# EAGLE schematic x16-to-mxm3 (EAGLE 9.6.2)
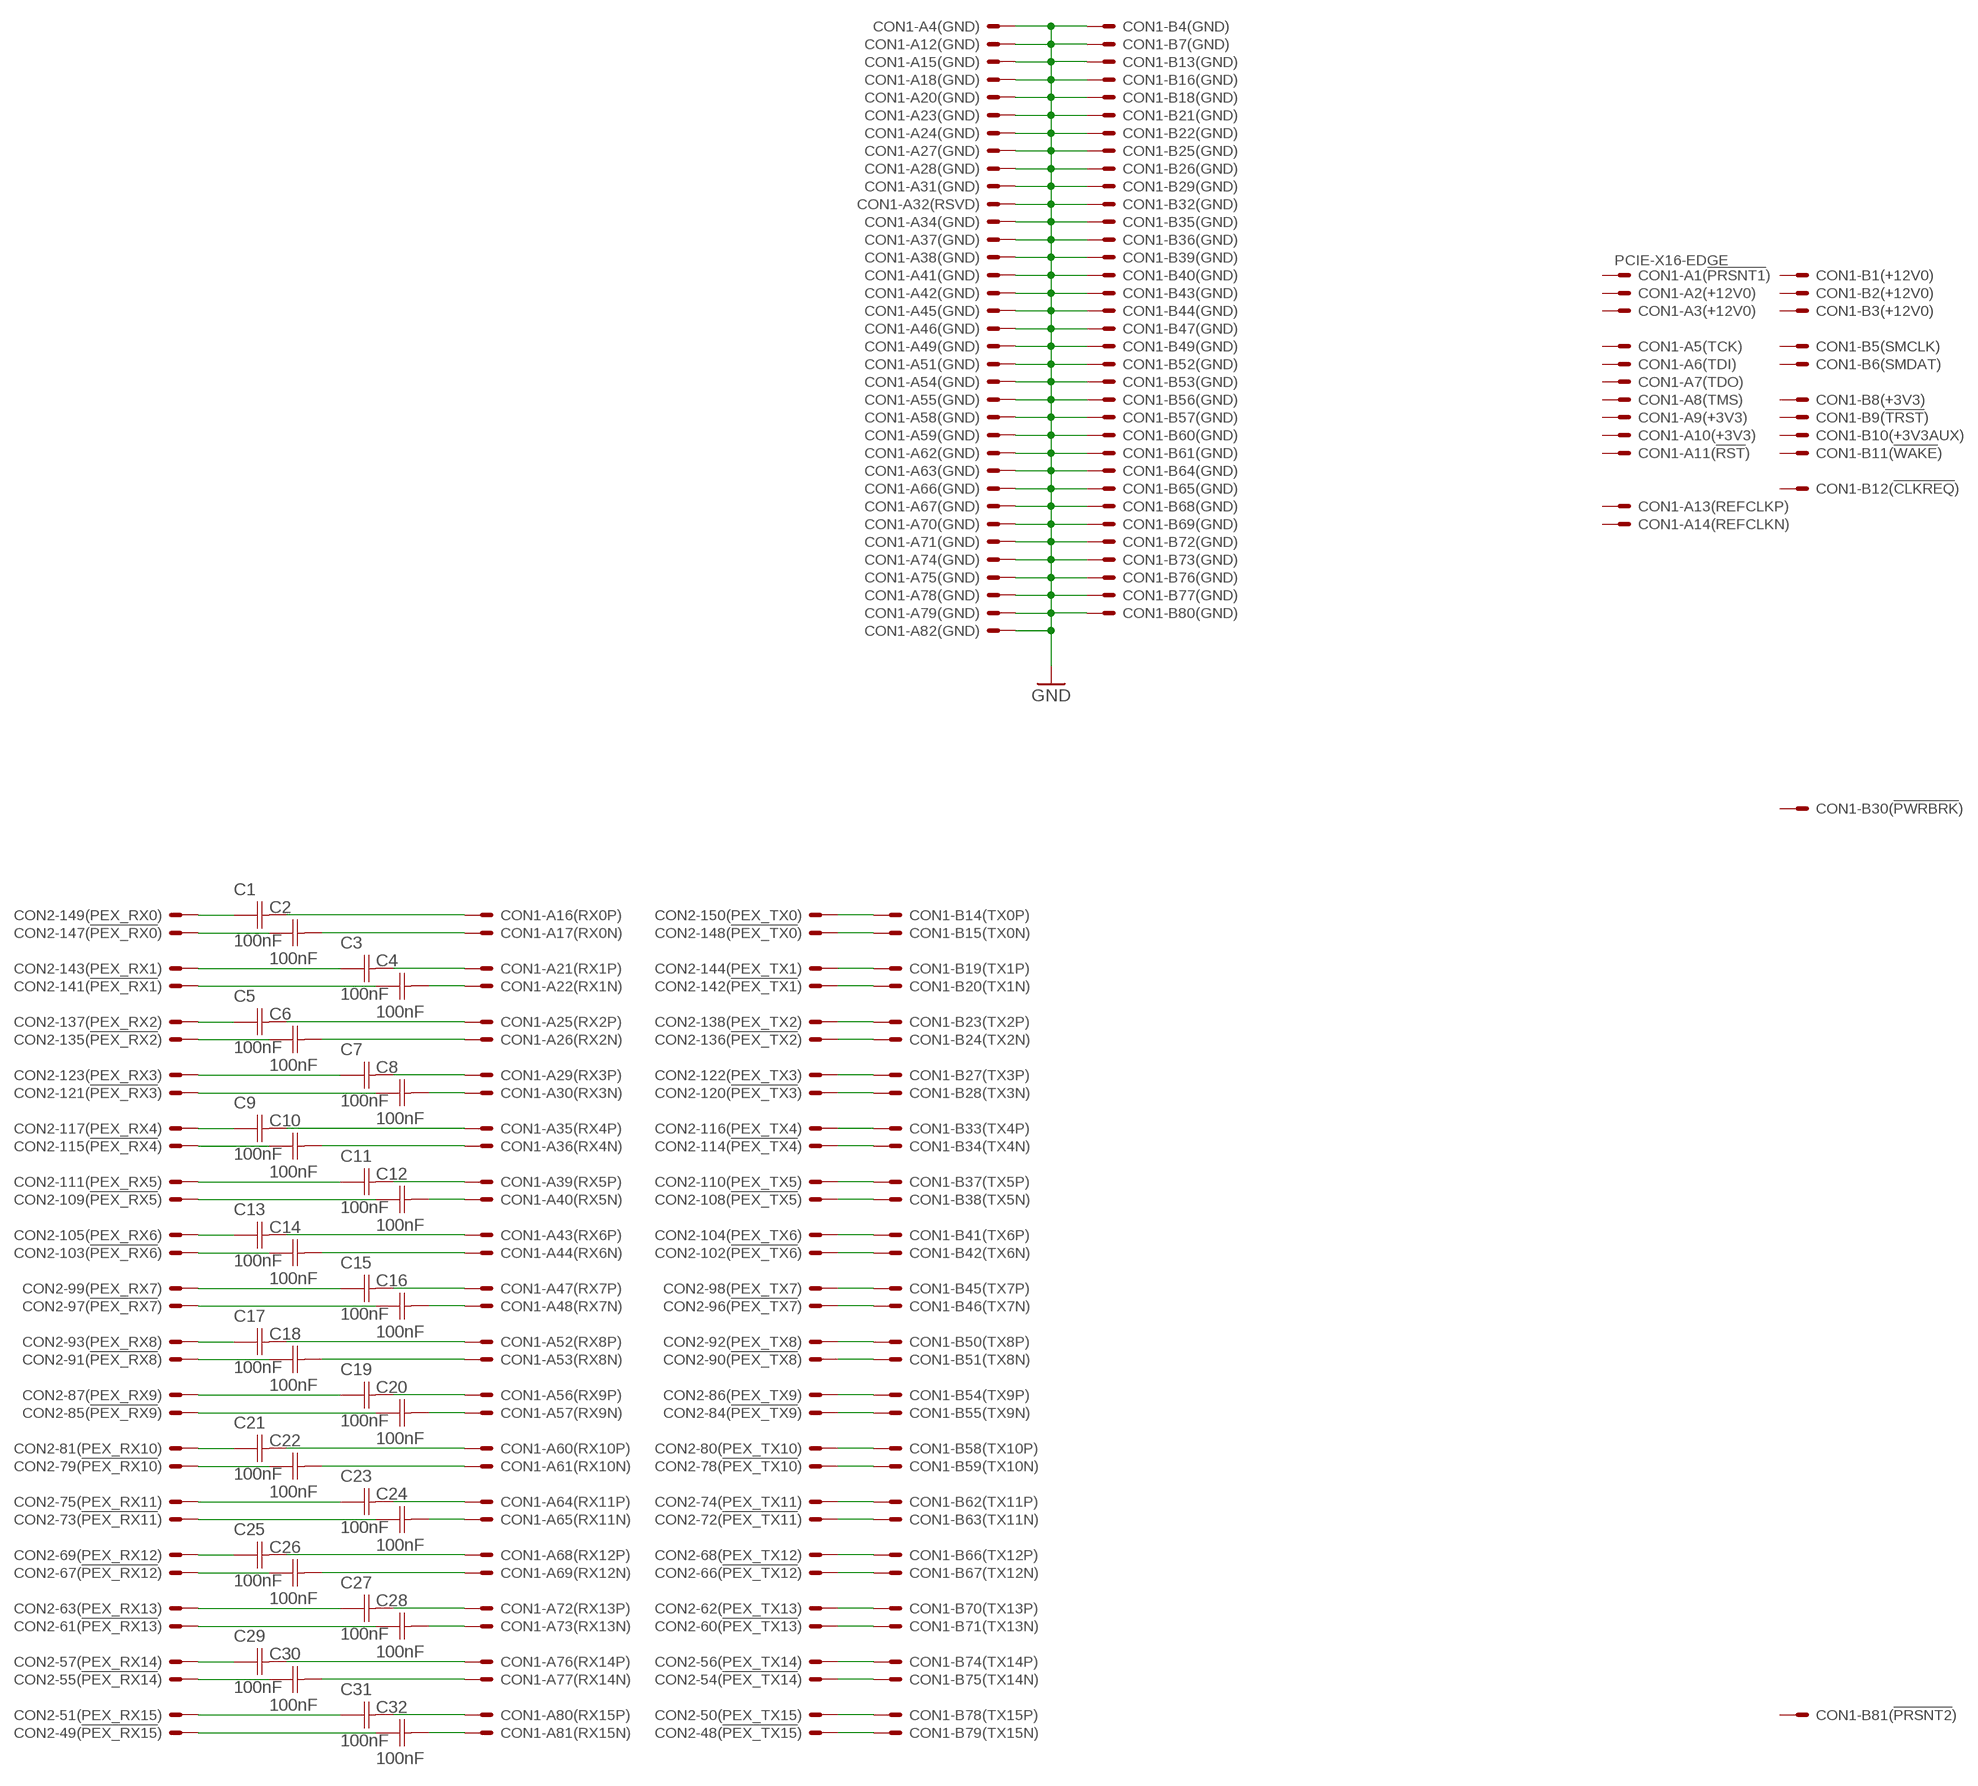
[diagram p0: schematic, sheet 1, part 1 of 2]
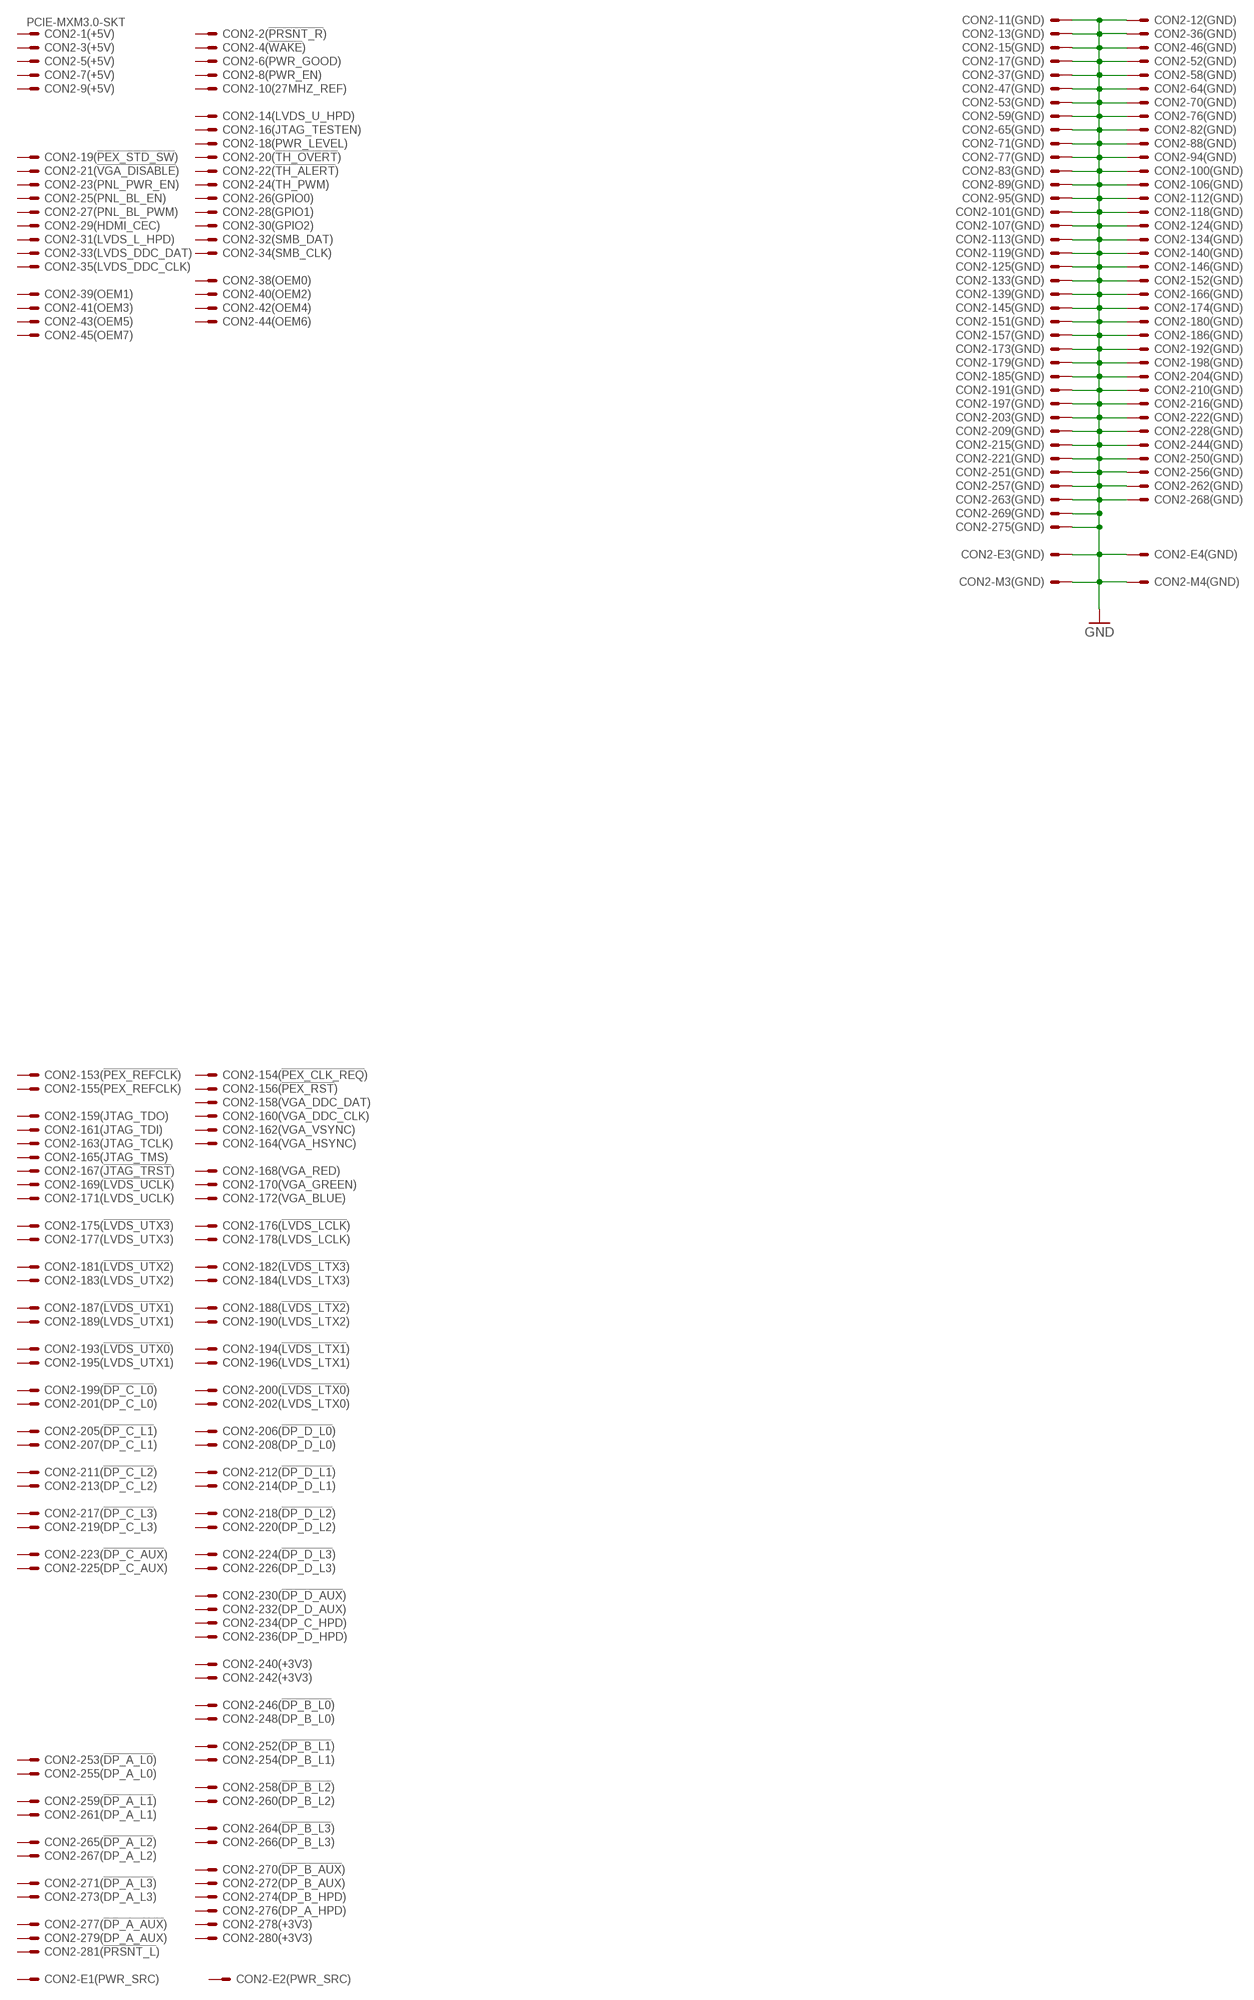
[diagram p1: schematic, sheet 1, part 2 of 2]

## Parts
C1  100nF  CAPACITOR-0402  [CAP0402]
C2  100nF  CAPACITOR-0402  [CAP0402]
C3  100nF  CAPACITOR-0402  [CAP0402]
C4  100nF  CAPACITOR-0402  [CAP0402]
C5  100nF  CAPACITOR-0402  [CAP0402]
C6  100nF  CAPACITOR-0402  [CAP0402]
C7  100nF  CAPACITOR-0402  [CAP0402]
C8  100nF  CAPACITOR-0402  [CAP0402]
C9  100nF  CAPACITOR-0402  [CAP0402]
C10  100nF  CAPACITOR-0402  [CAP0402]
C11  100nF  CAPACITOR-0402  [CAP0402]
C12  100nF  CAPACITOR-0402  [CAP0402]
C13  100nF  CAPACITOR-0402  [CAP0402]
C14  100nF  CAPACITOR-0402  [CAP0402]
C15  100nF  CAPACITOR-0402  [CAP0402]
C16  100nF  CAPACITOR-0402  [CAP0402]
C17  100nF  CAPACITOR-0402  [CAP0402]
C18  100nF  CAPACITOR-0402  [CAP0402]
C19  100nF  CAPACITOR-0402  [CAP0402]
C20  100nF  CAPACITOR-0402  [CAP0402]
C21  100nF  CAPACITOR-0402  [CAP0402]
C22  100nF  CAPACITOR-0402  [CAP0402]
C23  100nF  CAPACITOR-0402  [CAP0402]
C24  100nF  CAPACITOR-0402  [CAP0402]
C25  100nF  CAPACITOR-0402  [CAP0402]
C26  100nF  CAPACITOR-0402  [CAP0402]
C27  100nF  CAPACITOR-0402  [CAP0402]
C28  100nF  CAPACITOR-0402  [CAP0402]
C29  100nF  CAPACITOR-0402  [CAP0402]
C30  100nF  CAPACITOR-0402  [CAP0402]
C31  100nF  CAPACITOR-0402  [CAP0402]
C32  100nF  CAPACITOR-0402  [CAP0402]
CON1  PCIE-X16-EDGE  [PCIE-X16-EDGE]
CON2  PCIE-MXM3.0-SKT  [PCIE-MXM3.0-SKT]

## Nets
GND: CON1.A4 CON1.A12 CON1.A15 CON1.A18 CON1.A20 CON1.A23 CON1.A24 CON1.A27 CON1.A28 CON1.A31 CON1.A32 CON1.A34 CON1.A37 CON1.A38 CON1.A41 CON1.A42 CON1.A45 CON1.A46 CON1.A49 CON1.A51 CON1.A54 CON1.A55 CON1.A58 CON1.A59 CON1.A62 CON1.A63 CON1.A66 CON1.A67 CON1.A70 CON1.A71 CON1.A74 CON1.A75 CON1.A78 CON1.A79 CON1.A82 CON1.B4 CON1.B7 CON1.B13 CON1.B16 CON1.B18 CON1.B21 CON1.B22 CON1.B25 CON1.B26 CON1.B29 CON1.B32 CON1.B35 CON1.B36 CON1.B39 CON1.B40 CON1.B43 CON1.B44 CON1.B47 CON1.B49 CON1.B52 CON1.B53 CON1.B56 CON1.B57 CON1.B60 CON1.B61 CON1.B64 CON1.B65 CON1.B68 CON1.B69 CON1.B72 CON1.B73 CON1.B76 CON1.B77 CON1.B80 CON2.11 CON2.12 CON2.13 CON2.15 CON2.17 CON2.36 CON2.37 CON2.46 CON2.47 CON2.52 CON2.53 CON2.58 CON2.59 CON2.64 CON2.65 CON2.70 CON2.71 CON2.76 CON2.77 CON2.82 CON2.83 CON2.88 CON2.89 CON2.94 CON2.95 CON2.100 CON2.101 CON2.106 CON2.107 CON2.112 CON2.113 CON2.118 CON2.119 CON2.124 CON2.125 CON2.133 CON2.134 CON2.139 CON2.140 CON2.145 CON2.146 CON2.151 CON2.152 CON2.157 CON2.166 CON2.173 CON2.174 CON2.179 CON2.180 CON2.185 CON2.186 CON2.191 CON2.192 CON2.197 CON2.198 CON2.203 CON2.204 CON2.209 CON2.210 CON2.215 CON2.216 CON2.221 CON2.222 CON2.228 CON2.244 CON2.250 CON2.251 CON2.256 CON2.257 CON2.262 CON2.263 CON2.268 CON2.269 CON2.275 CON2.E3 CON2.E4 CON2.M3 CON2.M4
N$1: CON1.B14 CON2.150
N$2: CON1.B15 CON2.148
N$3: CON1.B19 CON2.144
N$4: CON1.B20 CON2.142
N$5: CON1.B23 CON2.138
N$6: CON1.B24 CON2.136
N$7: CON1.B27 CON2.122
N$8: CON1.B28 CON2.120
N$9: CON1.B33 CON2.116
N$10: CON1.B34 CON2.114
N$11: CON1.B37 CON2.110
N$12: CON1.B38 CON2.108
N$13: CON1.B41 CON2.104
N$14: CON1.B42 CON2.102
N$15: CON1.B45 CON2.98
N$16: CON1.B46 CON2.96
N$17: CON1.B50 CON2.92
N$18: CON1.B51 CON2.90
N$19: CON1.B54 CON2.86
N$20: CON1.B55 CON2.84
N$21: CON1.B58 CON2.80
N$22: CON1.B59 CON2.78
N$23: CON1.B62 CON2.74
N$24: CON1.B63 CON2.72
N$25: CON1.B66 CON2.68
N$26: CON1.B67 CON2.66
N$27: CON1.B70 CON2.62
N$28: CON1.B71 CON2.60
N$29: CON1.B74 CON2.56
N$30: CON1.B75 CON2.54
N$31: CON1.B78 CON2.50
N$32: CON1.B79 CON2.48
N$33: C4.2(C2) CON1.A22
N$34: C8.2(C2) CON1.A30
N$35: C12.2(C2) CON1.A40
N$36: C16.2(C2) CON1.A48
N$37: C20.2(C2) CON1.A57
N$38: C24.2(C2) CON1.A65
N$39: C28.2(C2) CON1.A73
N$40: C32.2(C2) CON1.A81
N$41: C2.2(C2) CON1.A17
N$42: C6.2(C2) CON1.A26
N$43: C10.2(C2) CON1.A36
N$44: C14.2(C2) CON1.A44
N$45: C18.2(C2) CON1.A53
N$46: C22.2(C2) CON1.A61
N$47: C26.2(C2) CON1.A69
N$48: C30.2(C2) CON1.A77
N$49: C1.2(C2) CON1.A16
N$50: C5.2(C2) CON1.A25
N$51: C9.2(C2) CON1.A35
N$52: C13.2(C2) CON1.A43
N$53: C17.2(C2) CON1.A52
N$54: C21.2(C2) CON1.A60
N$55: C25.2(C2) CON1.A68
N$56: C29.2(C2) CON1.A76
N$57: C3.2(C2) CON1.A21
N$58: C7.2(C2) CON1.A29
N$59: C11.2(C2) CON1.A39
N$60: C15.2(C2) CON1.A47
N$61: C19.2(C2) CON1.A56
N$62: C23.2(C2) CON1.A64
N$63: C27.2(C2) CON1.A72
N$64: C31.2(C2) CON1.A80
N$65: C29.1(C1) CON2.57
N$66: C25.1(C1) CON2.69
N$67: C21.1(C1) CON2.81
N$68: C17.1(C1) CON2.93
N$69: C13.1(C1) CON2.105
N$70: C9.1(C1) CON2.117
N$71: C5.1(C1) CON2.137
N$72: C1.1(C1) CON2.149
N$73: C31.1(C1) CON2.51
N$74: C27.1(C1) CON2.63
N$75: C23.1(C1) CON2.75
N$76: C19.1(C1) CON2.87
N$77: C15.1(C1) CON2.99
N$78: C7.1(C1) CON2.123
N$79: C3.1(C1) CON2.143
N$80: C30.1(C1) CON2.55
N$81: C26.1(C1) CON2.67
N$82: C22.1(C1) CON2.79
N$83: C18.1(C1) CON2.91
N$84: C14.1(C1) CON2.103
N$85: C10.1(C1) CON2.115
N$86: C6.1(C1) CON2.135
N$87: C2.1(C1) CON2.147
N$88: C32.1(C1) CON2.49
N$89: C28.1(C1) CON2.61
N$90: C24.1(C1) CON2.73
N$91: C20.1(C1) CON2.85
N$92: C16.1(C1) CON2.97
N$93: C12.1(C1) CON2.109
N$94: C8.1(C1) CON2.121
N$95: C4.1(C1) CON2.141
N$96: C11.1(C1) CON2.111
Unconnected: CON1.A1 CON1.A2 CON1.A3 CON1.A5 CON1.A6 CON1.A7 CON1.A8 CON1.A9 CON1.A10 CON1.A11 CON1.A13 CON1.A14 CON1.A19 CON1.A33 CON1.A50 CON1.B1 CON1.B2 CON1.B3 CON1.B5 CON1.B6 CON1.B8 CON1.B9 CON1.B10 CON1.B11 CON1.B12 CON1.B17 CON1.B30 CON1.B31 CON1.B48 CON1.B81 CON1.B82 CON2.1 CON2.2 CON2.3 CON2.4 CON2.5 CON2.6 CON2.7 CON2.8 CON2.9 CON2.10 CON2.14 CON2.16 CON2.18 CON2.19 CON2.20 CON2.21 CON2.22 CON2.23 CON2.24 CON2.25 CON2.26 CON2.27 CON2.28 CON2.29 CON2.30 CON2.31 CON2.32 CON2.33 CON2.34 CON2.35 CON2.38 CON2.39 CON2.40 CON2.41 CON2.42 CON2.43 CON2.44 CON2.45 CON2.153 CON2.154 CON2.155 CON2.156 CON2.158 CON2.159 CON2.160 CON2.161 CON2.162 CON2.163 CON2.164 CON2.165 CON2.167 CON2.168 CON2.169 CON2.170 CON2.171 CON2.172 CON2.175 CON2.176 CON2.177 CON2.178 CON2.181 CON2.182 CON2.183 CON2.184 CON2.187 CON2.188 CON2.189 CON2.190 CON2.193 CON2.194 CON2.195 CON2.196 CON2.199 CON2.200 CON2.201 CON2.202 CON2.205 CON2.206 CON2.207 CON2.208 CON2.211 CON2.212 CON2.213 CON2.214 CON2.217 CON2.218 CON2.219 CON2.220 CON2.223 CON2.224 CON2.225 CON2.226 CON2.227 CON2.229 CON2.230 CON2.231 CON2.232 CON2.233 CON2.234 CON2.235 CON2.236 CON2.237 CON2.238 CON2.239 CON2.240 CON2.241 CON2.242 CON2.243 CON2.245 CON2.246 CON2.247 CON2.248 CON2.249 CON2.252 CON2.253 CON2.254 CON2.255 CON2.258 CON2.259 CON2.260 CON2.261 CON2.264 CON2.265 CON2.266 CON2.267 CON2.270 CON2.271 CON2.272 CON2.273 CON2.274 CON2.276 CON2.277 CON2.278 CON2.279 CON2.280 CON2.281 CON2.E1 CON2.E2 CON2.M1 CON2.M2

## Library data of the parts
C1-C32 = Capacitor:CAPACITOR
CON1 = PCI Express:PCIE-X16-*
CON2 = PCI Express:PCIE-MXM3.0-*